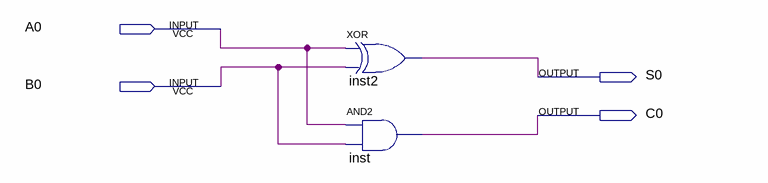
[diagram p0: schematic sheet]
// Quartus schematic halfadder.bdf as structural Verilog: 2 symbols, 4 pins
module halfadder (
  input  A0,
  input  B0,
  output S0,
  output C0
);

  xor inst2 (S0, A0, B0);
  and inst (C0, A0, B0);
endmodule
